# Altium schematic sheet 5V_converter.SchDoc
size A4; SheetNumber: 2; SheetTotal: 2
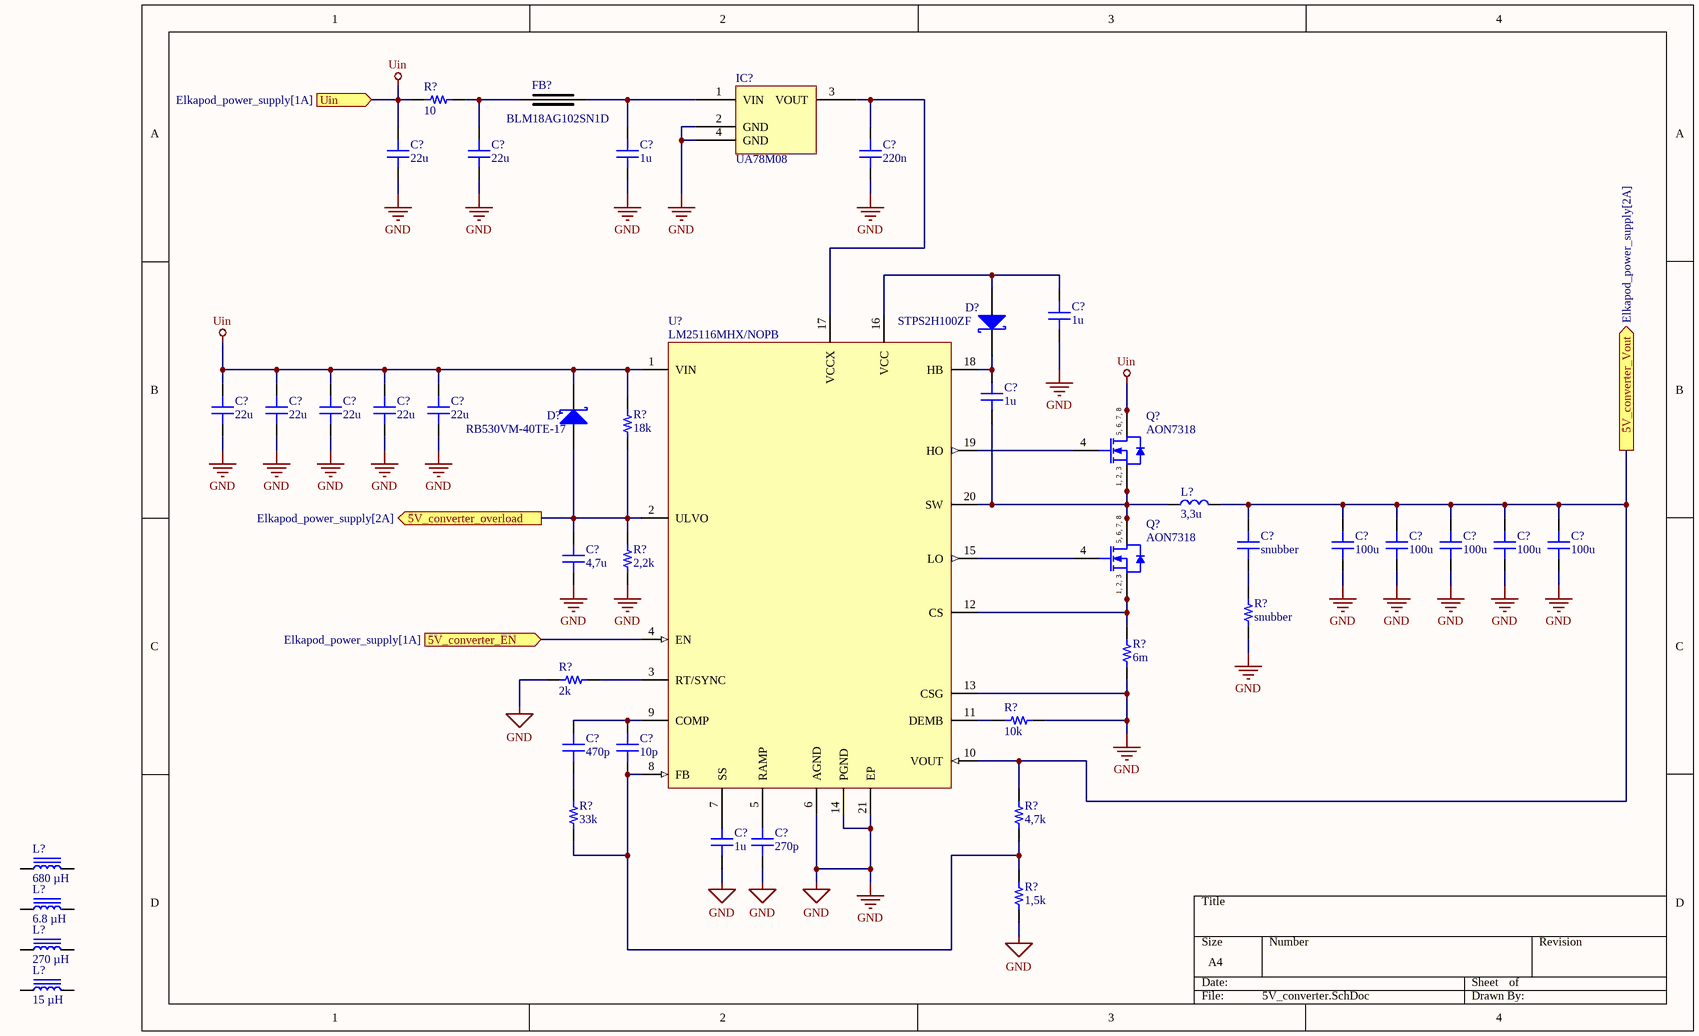
[diagram p0: 5V_converter.SchDoc]

## Parts
(Parts that share a designator on the sheet are numbered #1, #2 ... from top to bottom, then left to right.)
C?#1  22u  [CAP 0805_2012]
C?#2  22u  [CAP 0805_2012]
C?#3  1u  [CAP 0603_1608]
C?#4  220n  [CAP 0603_1608]
C?#5  1u  [CAP 0603_1608]
C?#6  1u  [CAP 0603_1608]
C?#7  22u  [CAP 0805_2012]
C?#8  22u  [CAP 0805_2012]
C?#9  22u  [CAP 0805_2012]
C?#10  22u  [CAP 0805_2012]
C?#11  22u  [CAP 0805_2012]
C?#12  snubber  [CAP 0603_1608]
C?#13  100u  [CAP 1210_3225 - 1MM]
C?#14  100u  [CAP 1210_3225 - 1MM]
C?#15  100u  [CAP 1210_3225 - 1MM]
C?#16  100u  [CAP 1210_3225 - 1MM]
C?#17  100u  [CAP 1210_3225 - 1MM]
C?#18  4,7u  [CAP 0603_1608]
C?#19  470p  [CAP 0603_1608]
C?#20  10p  [CAP 0603_1608]
C?#21  1u  [CAP 0603_1608]
C?#22  270p  [CAP 0603_1608]
D?#1  STPS2H100ZF  [DIOD-SOD-123-2_V]
D?#2  RB530VM-40TE-17  [SOD-323]
FB?  BLM18AG102SN1D  [0603FB-1KZ]
IC?  UA78M08  [TI SOT-223 DCY]
L?#1  3,3u  [13,2x12,5_INDUCTOR]
L?#2  680 µH  [TDK SLF12555]
L?#3  6.8 µH  [WURTH WE-PD 1260]
L?#4  270 µH  [BOURNS SRR1280]
L?#5  15 µH  [TAIYO YUDEN NRS5030]
Q?#1  AON7318  [INF-PG-TSDSON-8-1_V]
Q?#2  AON7318  [INF-PG-TSDSON-8-1_V]
R?#1  10  [RES 1206_3216]
R?#2  18k  [RES 0603_1608]
R?#3  2,2k  [RES 0603_1608]
R?#4  snubber  [RES 1206_3216]
R?#5  6m  [STACKPOLE CSM2512]
R?#6  2k  [RES 0603_1608]
R?#7  10k  [RES 0603_1608]
R?#8  33k  [RES 0603_1608]
R?#9  4,7k  [RES 0603_1608]
R?#10  1,5k  [RES 0603_1608]
U?  LM25116MHX/NOPB  [PWP0020A_L]

## Ports
5V_converter_EN (in, see Elkapod_power_supply[1A]), 5V_converter_overload (out, see Elkapod_power_supply[2A]), 5V_converter_Vout (out, see Elkapod_power_supply[2A]), Uin (in, see Elkapod_power_supply[1A])

## Nets
GND: C?#1.1 C?#2.1 C?#3.1 C?#4.1 C?#5.2 C?#7.1 C?#8.1 C?#9.1 C?#10.1 C?#11.1 C?#13.1 C?#14.1 C?#15.1 C?#16.1 C?#17.1 C?#18.1 C?#21.1 C?#22.1 IC?.2(GND) IC?.4(GND) R?#3.1 R?#4.1 R?#5.1 R?#6.2 R?#7.1 R?#10.2 U?.6(AGND) U?.13(CSG) U?.14(PGND) U?.21(EP)
Uin: C?#1.2 C?#7.2 C?#8.2 C?#9.2 C?#10.2 C?#11.2 D?#2.1(K) Q?#1.5(DRAIN) Q?#1.6(DRAIN) Q?#1.7(DRAIN) Q?#1.8(DRAIN) R?#1.1 R?#2.1 U?.1(VIN) ; port Uin
5V_converter_EN: U?.4(EN) ; port 5V_converter_EN
5V_converter_overload: C?#18.2 D?#2.2(A) R?#2.2 R?#3.2 U?.2(ULVO) ; port 5V_converter_overload
5V_converter_Vout: C?#12.2 C?#13.2 C?#14.2 C?#15.2 C?#16.2 C?#17.2 L?#1.2 R?#9.1 U?.10(VOUT) ; port 5V_converter_Vout
NetC?#2_2: C?#2.2 FB?.1 R?#1.2
NetC?#3_2: C?#3.2 FB?.2 IC?.1(VIN)
NetC?#4_2: C?#4.2 IC?.3(VOUT) U?.17(VCCX)
NetC?#5_1: C?#5.1 D?#1.1(A) U?.16(VCC)
NetC?#6_1: C?#6.1 L?#1.1 Q?#1.1(SOURCE) Q?#1.2(SOURCE) Q?#1.3(SOURCE) Q?#2.5(DRAIN) Q?#2.6(DRAIN) Q?#2.7(DRAIN) Q?#2.8(DRAIN) U?.20(SW)
NetC?#6_2: C?#6.2 D?#1.2(K) U?.18(HB)
NetC?#12_1: C?#12.1 R?#4.2
NetC?#19_1: C?#19.1 C?#20.1 U?.9(COMP)
NetC?#19_2: C?#19.2 R?#8.1
NetC?#20_2: C?#20.2 R?#8.2 R?#9.2 R?#10.1 U?.8(FB)
NetC?#21_2: C?#21.2 U?.7(SS)
NetC?#22_2: C?#22.2 U?.5(RAMP)
NetQ?#1_4: Q?#1.4(GATE) U?.19(HO)
NetQ?#2_1: Q?#2.1(SOURCE) Q?#2.2(SOURCE) Q?#2.3(SOURCE) R?#5.2 U?.12(CS)
NetQ?#2_4: Q?#2.4(GATE) U?.15(LO)
NetR?#6_1: R?#6.1 U?.3(RT/SYNC)
NetR?#7_2: R?#7.2 U?.11(DEMB)

Not connected (* = marked no-connect by the designer): L?#2 1 2; L?#3 1 2; L?#4 1 2; L?#5 1 2

## Notes on the sheet
- (in symbol BSZ050N03MS G) 5, 6, 7, 8; 1, 2, 3

## Library data of the parts
C?#1 C?#2 C?#7-C?#11 = VJ0805Y684KXQTW1BC: CAP CER 22UF 25V X7R 0805; manufacturer: Vishay Vitramon; Tolerance: ±10%; Voltage - Rated: 10V; Part Number: VJ0805Y684KXQTW1BC; Value: 22u; Applications: General Purpose; Capacitance: 22u; componentlink1description: Datasheet; componentlink1url: https://www.vishay.com/docs/28548/vjw1bcbascomseries.pdf; componentlink2description: DigiKey Link; componentlink2url: https://www.digikey.com/en/products/detail/vishay-vitramon/VJ0805Y684KXQTW1BC/8313569; Device Package: 0805 (2012 Metric); lastupdated: 09.02.2024 20:13:13; Lifecycle Status: Active; Minimum Order: 1; Mounting Type: Surface Mount, MLCC; Operating Temperature: -55°C ~ 125°C; Package / Case: 0805 (2012 Metric); packaging: TapeAndReel; partid: 57262; price: 0.05; series: VJ W1BC; Size / Dimension: 0.079" L x 0.049" W (2.00mm x 1.25mm); Temperature Coefficient: X7R; Thickness (Max): 0.053" (1.35mm)
C?#3 C?#5 C?#6 = C0603C272F3GAC7867: CAP CER 1uF 25V X5R 0603; manufacturer: KEMET; Temperature Coefficient: C0G, NP0; Tolerance: ±1%; Part Number: C0603C272F3GAC7867; Value: 1u; Applications: General Purpose; Capacitance: 1u; componentlink1description: Datasheet; componentlink1url: https://api.kemet.com/component-edge/download/datasheet/C0603C272F3GACTU.pdf; componentlink2description: DigiKey Link; componentlink2url: https://www.digikey.com/en/products/detail/kemet/C0603C272F3GAC7867/2200413; Device Package: 0603 (1608 Metric); Features: Low ESL; lastupdated: 09.02.2024 20:10:30; Lifecycle Status: Active; Minimum Order: 1; Mounting Type: Surface Mount, MLCC; Operating Temperature: -55°C ~ 125°C; Package / Case: 0603 (1608 Metric); packaging: TapeAndReel; partid: 2138; Part Status: Active; price: 0.40; series: SMD Comm C0G; Size / Dimension: 0.063" L x 0.031" W (1.60mm x 0.80mm); Thickness (Max): 0.034" (0.87mm); Voltage - Rated: 25V
C?#4 = C0603C272F3GAC7867: CAP CER 220nF 25V X5R 0603; manufacturer: KEMET; Temperature Coefficient: C0G, NP0; Tolerance: ±1%; Part Number: C0603C272F3GAC7867; Value: 220n; Applications: General Purpose; Capacitance: 220n; componentlink1description: Datasheet; componentlink1url: https://api.kemet.com/component-edge/download/datasheet/C0603C272F3GACTU.pdf; componentlink2description: DigiKey Link; componentlink2url: https://www.digikey.com/en/products/detail/kemet/C0603C272F3GAC7867/2200413; Device Package: 0603 (1608 Metric); Features: Low ESL; lastupdated: 09.02.2024 20:10:30; Lifecycle Status: Active; Minimum Order: 1; Mounting Type: Surface Mount, MLCC; Operating Temperature: -55°C ~ 125°C; Package / Case: 0603 (1608 Metric); packaging: TapeAndReel; partid: 2138; Part Status: Active; price: 0.40; series: SMD Comm C0G; Size / Dimension: 0.063" L x 0.031" W (1.60mm x 0.80mm); Thickness (Max): 0.034" (0.87mm); Voltage - Rated: 25V
C?#12 = C0603C272F3GAC7867: CAP CER 50V X5R 0603; manufacturer: KEMET; Temperature Coefficient: C0G, NP0; Tolerance: ±1%; Voltage - Rated: 25V; Part Number: C0603C272F3GAC7867; Value: snubber; Applications: General Purpose; Capacitance: snubber; componentlink1description: Datasheet; componentlink1url: https://api.kemet.com/component-edge/download/datasheet/C0603C272F3GACTU.pdf; componentlink2description: DigiKey Link; componentlink2url: https://www.digikey.com/en/products/detail/kemet/C0603C272F3GAC7867/2200413; Device Package: 0603 (1608 Metric); Features: Low ESL; lastupdated: 09.02.2024 20:10:30; Lifecycle Status: Active; Minimum Order: 1; Mounting Type: Surface Mount, MLCC; Operating Temperature: -55°C ~ 125°C; Package / Case: 0603 (1608 Metric); packaging: TapeAndReel; partid: 2138; Part Status: Active; price: 0.40; series: SMD Comm C0G; Size / Dimension: 0.063" L x 0.031" W (1.60mm x 0.80mm); Thickness (Max): 0.034" (0.87mm)
C?#13-C?#17 = CAN13X104KARAC7800: CAP CER 1210 100UF 10V X7R; manufacturer: KEMET; Tolerance: ±10%; Voltage - Rated: 250VAC; Part Number: CAN13X104KARAC7800; Value: 100u; Applications: Boardflex Sensitive; Capacitance: 100u; componentlink1description: Datasheet; componentlink1url: //media.digikey.com/pdf/Data%20Sheets/Kemet%20PDFs/CAN13X104KARACTU_Spec.pdf; componentlink2description: DigiKey Link; componentlink2url: https://www.digikey.com/en/products/detail/kemet/CAN13X104KARAC7800/9962480; Device Package: 1210 (3225 Metric); Features: Low ESL, Soft Termination; lastupdated: 04.06.2024 19:21:07; Lifecycle Status: Active; Minimum Order: 1; Mounting Type: Surface Mount, MLCC; Operating Temperature: -55°C ~ 125°C; Package / Case: 1210 (3225 Metric); packaging: TapeAndReel; partid: 23615; Part Status: Active; price: 0.39; series: CAN SMD Indust X7R; Size / Dimension: 0.130" L x 0.102" W (3.30mm x 2.60mm); Temperature Coefficient: X7R; Thickness (Max): 0.110" (2.80mm)
C?#18 = C0603C272F3GAC7867: CAP CER 4,7uF 25V X5R 0603; manufacturer: KEMET; Temperature Coefficient: C0G, NP0; Tolerance: ±1%; Part Number: C0603C272F3GAC7867; Value: 4,7u; Applications: General Purpose; Capacitance: 4,7u; componentlink1description: Datasheet; componentlink1url: https://api.kemet.com/component-edge/download/datasheet/C0603C272F3GACTU.pdf; componentlink2description: DigiKey Link; componentlink2url: https://www.digikey.com/en/products/detail/kemet/C0603C272F3GAC7867/2200413; Device Package: 0603 (1608 Metric); Features: Low ESL; lastupdated: 09.02.2024 20:10:30; Lifecycle Status: Active; Minimum Order: 1; Mounting Type: Surface Mount, MLCC; Operating Temperature: -55°C ~ 125°C; Package / Case: 0603 (1608 Metric); packaging: TapeAndReel; partid: 2138; Part Status: Active; price: 0.40; series: SMD Comm C0G; Size / Dimension: 0.063" L x 0.031" W (1.60mm x 0.80mm); Thickness (Max): 0.034" (0.87mm); Voltage - Rated: 25V
C?#19 = C0603C272F3GAC7867: CAP CER 470pF 50V G0C 0603; manufacturer: KEMET; Temperature Coefficient: C0G, NP0; Tolerance: ±1%; Voltage - Rated: 25V; Part Number: C0603C272F3GAC7867; Value: 470p; Applications: General Purpose; Capacitance: 470p; componentlink1description: Datasheet; componentlink1url: https://api.kemet.com/component-edge/download/datasheet/C0603C272F3GACTU.pdf; componentlink2description: DigiKey Link; componentlink2url: https://www.digikey.com/en/products/detail/kemet/C0603C272F3GAC7867/2200413; Device Package: 0603 (1608 Metric); Features: Low ESL; lastupdated: 09.02.2024 20:10:30; Lifecycle Status: Active; Minimum Order: 1; Mounting Type: Surface Mount, MLCC; Operating Temperature: -55°C ~ 125°C; Package / Case: 0603 (1608 Metric); packaging: TapeAndReel; partid: 2138; Part Status: Active; price: 0.40; series: SMD Comm C0G; Size / Dimension: 0.063" L x 0.031" W (1.60mm x 0.80mm); Thickness (Max): 0.034" (0.87mm)
C?#20 = C0603C272F3GAC7867: CAP CER 10pF 50V G0C 0603; manufacturer: KEMET; Temperature Coefficient: C0G, NP0; Tolerance: ±1%; Voltage - Rated: 25V; Part Number: C0603C272F3GAC7867; Value: 10p; Applications: General Purpose; Capacitance: 10p; componentlink1description: Datasheet; componentlink1url: https://api.kemet.com/component-edge/download/datasheet/C0603C272F3GACTU.pdf; componentlink2description: DigiKey Link; componentlink2url: https://www.digikey.com/en/products/detail/kemet/C0603C272F3GAC7867/2200413; Device Package: 0603 (1608 Metric); Features: Low ESL; lastupdated: 09.02.2024 20:10:30; Lifecycle Status: Active; Minimum Order: 1; Mounting Type: Surface Mount, MLCC; Operating Temperature: -55°C ~ 125°C; Package / Case: 0603 (1608 Metric); packaging: TapeAndReel; partid: 2138; Part Status: Active; price: 0.40; series: SMD Comm C0G; Size / Dimension: 0.063" L x 0.031" W (1.60mm x 0.80mm); Thickness (Max): 0.034" (0.87mm)
C?#21 = C0603C272F3GAC7867: CAP CER 1uF 16V X5R 0603; manufacturer: KEMET; Temperature Coefficient: C0G, NP0; Tolerance: ±1%; Voltage - Rated: 25V; Part Number: C0603C272F3GAC7867; Value: 1u; Applications: General Purpose; Capacitance: 1u; componentlink1description: Datasheet; componentlink1url: https://api.kemet.com/component-edge/download/datasheet/C0603C272F3GACTU.pdf; componentlink2description: DigiKey Link; componentlink2url: https://www.digikey.com/en/products/detail/kemet/C0603C272F3GAC7867/2200413; Device Package: 0603 (1608 Metric); Features: Low ESL; lastupdated: 09.02.2024 20:10:30; Lifecycle Status: Active; Minimum Order: 1; Mounting Type: Surface Mount, MLCC; Operating Temperature: -55°C ~ 125°C; Package / Case: 0603 (1608 Metric); packaging: TapeAndReel; partid: 2138; Part Status: Active; price: 0.40; series: SMD Comm C0G; Size / Dimension: 0.063" L x 0.031" W (1.60mm x 0.80mm); Thickness (Max): 0.034" (0.87mm)
C?#22 = C0603C272F3GAC7867: CAP CER 270pF 50V G0C 0603; manufacturer: KEMET; Temperature Coefficient: C0G, NP0; Tolerance: ±1%; Voltage - Rated: 25V; Part Number: C0603C272F3GAC7867; Value: 270p; Applications: General Purpose; Capacitance: 270p; componentlink1description: Datasheet; componentlink1url: https://api.kemet.com/component-edge/download/datasheet/C0603C272F3GACTU.pdf; componentlink2description: DigiKey Link; componentlink2url: https://www.digikey.com/en/products/detail/kemet/C0603C272F3GAC7867/2200413; Device Package: 0603 (1608 Metric); Features: Low ESL; lastupdated: 09.02.2024 20:10:30; Lifecycle Status: Active; Minimum Order: 1; Mounting Type: Surface Mount, MLCC; Operating Temperature: -55°C ~ 125°C; Package / Case: 0603 (1608 Metric); packaging: TapeAndReel; partid: 2138; Part Status: Active; price: 0.40; series: SMD Comm C0G; Size / Dimension: 0.063" L x 0.031" W (1.60mm x 0.80mm); Thickness (Max): 0.034" (0.87mm)
D?#1 = CMP-0303-00004-1: Schottky diode; 2A; 100V
D?#2 = BAS140W: Schottky diode; 0,1A; 40V; Published: 21-Mar-2003; LatestRevisionDate: 19-Mar-2004; LatestRevisionNote: Silkscreen size reduced.; DatasheetDocument: Oct-1999; PackageDocument: Sep-2000; PackageReference: SOD-323; Publisher: Altium Limited; ComponentLink1Description: Manufacturer Link; ComponentLink1URL: http://www.infineon.com/; ComponentLink2Description: Datasheet; ComponentLink2URL: http://www.infineon.com/upload/Document/cmc_upload/documents/009/386/bas70_bas170series_1.pdf
FB? = 0603FB-1KZ: FERRITE BEAD 1000 OHM 400mA
IC? = LM340MP-5.0/NOPB: IC REG LINEAR 8V 0,5A SOT223; Manufacturer: Texas Instruments; Current - Output: 1.5A; Number of Regulators: 1; Output Configuration: Positive; Output Type: Fixed; Part Number: UA78M08; ComponentLink1Description: Datasheet; ComponentLink1URL: http://www.ti.com/general/docs/suppproductinfo.tsp?distId=10&gotoUrl=http%3A%2F%2Fwww.ti.com%2Flit%2Fgpn%2Flm340; ComponentLink2Description: DigiKey Link; ComponentLink2URL: //digikey.com/product-detail/en/texas-instruments/LM340MP-5.0-NOPB/LM340MP-5.0-NOPBTR-ND/270717; Lifecycle Status: 0; Operating Temperature: 0°C ~ 125°C; Package / Case: TO-261-4, TO-261AA; Packaging: TapeAndReel; Voltage - Output (Min/Fixed): 8V
L?#1 = 13,2x12,5_INDUCTOR: SMD power inductor; Imax = 19,7A; Isat = 22,5A
L?#2 = SLF12555T-681MR43-PF: FIXED IND 680UH 730MA 912MOHM SM; Manufacturer: TDK Corporation; Current - Saturation: 430mA; DC Resistance (DCR): 912mOhm Max; Inductance Frequency - Test: 1 kHz; Material - Core: Ferrite; Shielding: Shielded; Tolerance: ±20%; Type: Drum Core, Wirewound; Part Number: SLF12555T-681MR43-PF; ComponentLink1Description: Datasheet; ComponentLink1URL: https://product.tdk.com/info/en/catalog/datasheets/inductor_commercial_power_slf12555_en.pdf?ref_disty=digikey; ComponentLink2Description: DigiKey Link; ComponentLink2URL: https://www.digikey.com/en/products/detail/tdk-corporation/SLF12555T-681MR43-PF/761650; Current Rating (Amps): 730 mA; Device Package: Nonstandard; Height - Seated (Max): 0.228" (5.80mm); Inductance: 680 µH; LastUpdated: 03.06.2024 20:02:40; Lifecycle Status: Active; Minimum Order: 1; Mounting Type: Surface Mount; Operating Temperature: -40°C ~ 105°C; Package / Case: Nonstandard; Packaging: TapeAndReel; PartId: 101; Part Status: Active; Price: 0.64; Series: SLF; Size / Dimension: 0.492" L x 0.492" W (12.50mm x 12.50mm); Supplier 1: DigiKey; Supplier Part Number 1: 445-174402-1-ND; Value: 680 µH
L?#3 = 744771006: FIXED IND 6.8UH 6.25A 22MOHM SMD; Manufacturer: Würth Elektronik; Current - Saturation: 6.4A; DC Resistance (DCR): 22mOhm Max; Frequency - Self Resonant: 27MHz; Inductance Frequency - Test: 1 kHz; Material - Core: Ferrite; Shielding: Shielded; Tolerance: ±20%; Type: Drum Core, Wirewound; Part Number: 744771006; ComponentLink1Description: Datasheet; ComponentLink1URL: https://katalog.we-online.de/pbs/datasheet/744771006.pdf; ComponentLink2Description: DigiKey Link; ComponentLink2URL: https://www.digikey.com/en/products/detail/würth-elektronik/744771006/3476684; Current Rating (Amps): 6.25 A; Device Package: Nonstandard; Height - Seated (Max): 0.236" (6.00mm); Inductance: 6.8 µH; LastUpdated: 03.06.2024 20:26:19; Lifecycle Status: Active; Minimum Order: 1; Mounting Type: Surface Mount; Operating Temperature: -40°C ~ 125°C; Package / Case: Nonstandard; Packaging: TapeAndReel; PartId: 5713; Part Status: Active; Price: 1.18; Ratings: AEC-Q200; Series: WE-PD; Size / Dimension: 0.472" L x 0.472" W (12.00mm x 12.00mm); Supplier 1: DigiKey; Supplier Part Number 1: 732-4114-1-ND; Value: 6.8 µH
L?#4 = SRR1280-271K: FIXED IND 270UH 1.2A 450MOHM SMD; Manufacturer: Bourns Inc.; Current - Saturation: 1.6A; DC Resistance (DCR): 450mOhm Max; Frequency - Self Resonant: 3.1MHz; Inductance Frequency - Test: 100 kHz; Material - Core: Ferrite; Q @ Freq: 20 @ 796kHz; Shielding: Shielded; Tolerance: ±10%; Type: Drum Core, Wirewound; Part Number: SRR1280-271K; ComponentLink1Description: Datasheet; ComponentLink1URL: https://www.bourns.com/docs/Product-Datasheets/SRR1280.pdf; ComponentLink2Description: DigiKey Link; ComponentLink2URL: https://www.digikey.com/en/products/detail/bourns-inc/SRR1280-271K/1970009; Current Rating (Amps): 1.2 A; Device Package: Nonstandard; Height - Seated (Max): 0.315" (8.00mm); Inductance: 270 µH; LastUpdated: 03.06.2024 20:02:37; Lifecycle Status: Active; Minimum Order: 1; Mounting Type: Surface Mount; Operating Temperature: -40°C ~ 125°C; Package / Case: Nonstandard; Packaging: TapeAndReel; PartId: 13; Part Status: Active; Price: 0.51; Series: SRR1280; Size / Dimension: 0.492" L x 0.492" W (12.50mm x 12.50mm); Supplier 1: DigiKey; Supplier Part Number 1: SRR1280-271KCT-ND; Value: 270 µH
L?#5 = NRS5030T150MMGJ: FIXED IND 15UH 1.4A 125 MOHM SMD; Manufacturer: Taiyo Yuden; Current - Saturation: 1.6A; Frequency - Self Resonant: 14MHz; Inductance Frequency - Test: 100 kHz; Material - Core: Ferrite; Shielding: Shielded; Tolerance: ±20%; Type: Drum Core, Wirewound; Part Number: NRS5030T150MMGJ; ComponentLink1Description: Datasheet; ComponentLink1URL: https://www.yuden.co.jp/productdata/catalog/wound04_e.pdf; ComponentLink2Description: DigiKey Link; ComponentLink2URL: https://www.digikey.com/en/products/detail/taiyo-yuden/NRS5030T150MMGJ/4157842; Current Rating (Amps): 1.4 A; DC Resistance (DCR): 125mOhm; Device Package: Nonstandard; Height - Seated (Max): 0.118" (3.00mm); Inductance: 15 µH; LastUpdated: 03.06.2024 20:23:07; Lifecycle Status: Active; Minimum Order: 1; Mounting Type: Surface Mount; Operating Temperature: -25°C ~ 120°C; Package / Case: Nonstandard; Packaging: TapeAndReel; PartId: 3411; Part Status: Active; Price: 0.11; Series: NR, S Type; Size / Dimension: 0.193" L x 0.193" W (4.90mm x 4.90mm); Supplier 1: DigiKey; Supplier Part Number 1: 587-3454-1-ND; Value: 15 µH
Q?#1 Q?#2 = BSZ050N03MS G: N-Channel Power-MOSFET, 30 V VDS, 50 A ID, PG-TSDSON-8-1; Manufacturer: Infineon; ID (max): 50 A; IDpuls (max): 190 A; Polarity: N; PackageReference: PG-TSDSON-8-1; PackageDescription: 8-Pin Plastic (Green) Thin Dual Small Outline Non-Leaded Package, 3.3 x 3.3 mm Body, 0.65 mm Pitch; Mounting Technology: Surface Mount
R?#1 = KRL1632E-M-R120-F-T5: RES 10 OHM 1% 3/4W 1206; Manufacturer: Susumu; Power (Watts): 0.75W, 3/4W; Temperature Coefficient: ±50ppm/°C; Part Number: KRL1632E-M-R120-F-T5; ComponentLink1Description: Datasheet; ComponentLink1URL: http://www.susumu.co.jp/common/pdf/n_catalog_partition09_en.pdf; ComponentLink2Description: DigiKey Link; ComponentLink2URL: https://www.digikey.com/en/products/detail/susumu/KRL1632E-M-R120-F-T5/3738009; Composition: Metal Foil; Device Package: 1206 (3216 Metric); Features: Automotive AEC-Q200, Current Sense; Height - Seated (Max): 0.028" (0.70mm); LastUpdated: 09.02.2024 20:54:46; Lifecycle Status: Active; Minimum Order: 1; Number of Terminations: 2; Operating Temperature: -55°C ~ 155°C; Package / Case: 1206 (3216 Metric); Packaging: TapeAndReel; PartId: 26840; Part Status: Active; Price: 0.09; Ratings: AEC-Q200; Resistance: 10; Series: KRL; Size / Dimension: 0.126" L x 0.063" W (3.20mm x 1.60mm); Supplier Device Package: 1206; Tolerance: ±1%; Value: 10
R?#2 = RNCS0603BKE10K0: RES 18K OHM 1% 0,1W 0603; Manufacturer: Stackpole Electronics Inc; Power (Watts): 0.063W, 1/16W; Temperature Coefficient: ±25ppm/°C; Tolerance: ±0.1%; Part Number: RNCS0603BKE10K0; Value: 18k; Composition: Thin Film; Device Package: 0603 (1608 Metric); Features: Anti-Corrosive, Automotive AEC-Q200, Moisture Resistant; Height - Seated (Max): 0.022" (0.55mm); LastUpdated: 09.02.2024 20:43:37; Lifecycle Status: Active; Minimum Order: 1; Number of Terminations: 2; Operating Temperature: -55°C ~ 155°C; Package / Case: 0603 (1608 Metric); Packaging: TapeAndReel; PartId: 4838; Part Status: Active; Price: 0.06; Ratings: AEC-Q200; Resistance: 18k; Series: RNCS; Size / Dimension: 0.061" L x 0.031" W (1.55mm x 0.80mm); Supplier Device Package: 0603
R?#3 = RNCS0603BKE10K0: RES 2,2K OHM 1% 0,1W 0603; Manufacturer: Stackpole Electronics Inc; Power (Watts): 0.063W, 1/16W; Temperature Coefficient: ±25ppm/°C; Tolerance: ±0.1%; Part Number: RNCS0603BKE10K0; Value: 2,2k; Composition: Thin Film; Device Package: 0603 (1608 Metric); Features: Anti-Corrosive, Automotive AEC-Q200, Moisture Resistant; Height - Seated (Max): 0.022" (0.55mm); LastUpdated: 09.02.2024 20:43:37; Lifecycle Status: Active; Minimum Order: 1; Number of Terminations: 2; Operating Temperature: -55°C ~ 155°C; Package / Case: 0603 (1608 Metric); Packaging: TapeAndReel; PartId: 4838; Part Status: Active; Price: 0.06; Ratings: AEC-Q200; Resistance: 2,2k; Series: RNCS; Size / Dimension: 0.061" L x 0.031" W (1.55mm x 0.80mm); Supplier Device Package: 0603
R?#4 = RT1206BRD0775KL: Manufacturer: Yageo; Power (Watts): 0.25W, 1/4W; Temperature Coefficient: ±25ppm/°C; Tolerance: ±0.1%; Part Number: RT1206BRD0775KL; Composition: Thin Film; Device Package: 1206 (3216 Metric); Height - Seated (Max): 0.026" (0.65mm); LastUpdated: 09.02.2024 20:54:46; Lifecycle Status: Active; Minimum Order: 1; Number of Terminations: 2; Operating Temperature: -55°C ~ 155°C; Package / Case: 1206 (3216 Metric); Packaging: TapeAndReel; PartId: 26866; Part Status: Active; Price: 0.09; Series: RT; Size / Dimension: 0.122" L x 0.063" W (3.10mm x 1.60mm); Supplier Device Package: 1206
R?#5 = CSM2512FT20L0: RES 0,006 OHM 1% 3W 2512; manufacturer: Stackpole Electronics Inc; Temperature Coefficient: ±50ppm/°C; value: 20 mOhms; Part Number: CSM2512FT20L0; componentlink1description: Datasheet; componentlink1url: https://www.seielect.com/Catalog/SEI-CSM.PDF; componentlink2description: DigiKey Link; componentlink2url: https://www.digikey.com/en/products/detail/stackpole-electronics-inc/CSM2512FT20L0/6270239; Composition: Metal Element; Device Package: 2512 (6332 Metric); Features: Current Sense; Height - Seated (Max): 0.035" (0.90mm); lastupdated: 03.06.2024 20:27:03; Lifecycle Status: Active; Minimum Order: 4000; Number of Terminations: 2; Operating Temperature: -55°C ~ 170°C; Package / Case: 2512 (6332 Metric); packaging: TapeAndReel; Part Status: Active; Power (Watts): 3W; price: 0.19; Resistance: 6m; series: CSM; Size / Dimension: 0.252" L x 0.126" W (6.40mm x 3.20mm); Supplier Device Package: 2512; Tolerance: ±1%
R?#6 = RNCS0603BKE10K0: RES 2K OHM 1% 0,1W 0603; Manufacturer: Stackpole Electronics Inc; Power (Watts): 0.063W, 1/16W; Temperature Coefficient: ±25ppm/°C; Tolerance: ±0.1%; Part Number: RNCS0603BKE10K0; Value: 2k; Composition: Thin Film; Device Package: 0603 (1608 Metric); Features: Anti-Corrosive, Automotive AEC-Q200, Moisture Resistant; Height - Seated (Max): 0.022" (0.55mm); LastUpdated: 09.02.2024 20:43:37; Lifecycle Status: Active; Minimum Order: 1; Number of Terminations: 2; Operating Temperature: -55°C ~ 155°C; Package / Case: 0603 (1608 Metric); Packaging: TapeAndReel; PartId: 4838; Part Status: Active; Price: 0.06; Ratings: AEC-Q200; Resistance: 2k; Series: RNCS; Size / Dimension: 0.061" L x 0.031" W (1.55mm x 0.80mm); Supplier Device Package: 0603
R?#7 = RNCS0603BKE10K0: RES 10K OHM 1% 0,1W 0603; Manufacturer: Stackpole Electronics Inc; Power (Watts): 0.063W, 1/16W; Temperature Coefficient: ±25ppm/°C; Tolerance: ±0.1%; Part Number: RNCS0603BKE10K0; Value: 10k; Composition: Thin Film; Device Package: 0603 (1608 Metric); Features: Anti-Corrosive, Automotive AEC-Q200, Moisture Resistant; Height - Seated (Max): 0.022" (0.55mm); LastUpdated: 09.02.2024 20:43:37; Lifecycle Status: Active; Minimum Order: 1; Number of Terminations: 2; Operating Temperature: -55°C ~ 155°C; Package / Case: 0603 (1608 Metric); Packaging: TapeAndReel; PartId: 4838; Part Status: Active; Price: 0.06; Ratings: AEC-Q200; Resistance: 10k; Series: RNCS; Size / Dimension: 0.061" L x 0.031" W (1.55mm x 0.80mm); Supplier Device Package: 0603
R?#8 = RNCS0603BKE10K0: RES 33K OHM 1% 0,1W 0603; Manufacturer: Stackpole Electronics Inc; Power (Watts): 0.063W, 1/16W; Temperature Coefficient: ±25ppm/°C; Tolerance: ±0.1%; Part Number: RNCS0603BKE10K0; Value: 33k; Composition: Thin Film; Device Package: 0603 (1608 Metric); Features: Anti-Corrosive, Automotive AEC-Q200, Moisture Resistant; Height - Seated (Max): 0.022" (0.55mm); LastUpdated: 09.02.2024 20:43:37; Lifecycle Status: Active; Minimum Order: 1; Number of Terminations: 2; Operating Temperature: -55°C ~ 155°C; Package / Case: 0603 (1608 Metric); Packaging: TapeAndReel; PartId: 4838; Part Status: Active; Price: 0.06; Ratings: AEC-Q200; Resistance: 33k; Series: RNCS; Size / Dimension: 0.061" L x 0.031" W (1.55mm x 0.80mm); Supplier Device Package: 0603
R?#9 = RNCS0603BKE10K0: RES 4,7K OHM 1% 0,1W 0603; Manufacturer: Stackpole Electronics Inc; Power (Watts): 0.063W, 1/16W; Temperature Coefficient: ±25ppm/°C; Tolerance: ±0.1%; Part Number: RNCS0603BKE10K0; Value: 4,7k; Composition: Thin Film; Device Package: 0603 (1608 Metric); Features: Anti-Corrosive, Automotive AEC-Q200, Moisture Resistant; Height - Seated (Max): 0.022" (0.55mm); LastUpdated: 09.02.2024 20:43:37; Lifecycle Status: Active; Minimum Order: 1; Number of Terminations: 2; Operating Temperature: -55°C ~ 155°C; Package / Case: 0603 (1608 Metric); Packaging: TapeAndReel; PartId: 4838; Part Status: Active; Price: 0.06; Ratings: AEC-Q200; Resistance: 4,7k; Series: RNCS; Size / Dimension: 0.061" L x 0.031" W (1.55mm x 0.80mm); Supplier Device Package: 0603
R?#10 = RNCS0603BKE10K0: RES 1,5K OHM 1% 0,1W 0603; Manufacturer: Stackpole Electronics Inc; Power (Watts): 0.063W, 1/16W; Temperature Coefficient: ±25ppm/°C; Tolerance: ±0.1%; Part Number: RNCS0603BKE10K0; Value: 1,5k; Composition: Thin Film; Device Package: 0603 (1608 Metric); Features: Anti-Corrosive, Automotive AEC-Q200, Moisture Resistant; Height - Seated (Max): 0.022" (0.55mm); LastUpdated: 09.02.2024 20:43:37; Lifecycle Status: Active; Minimum Order: 1; Number of Terminations: 2; Operating Temperature: -55°C ~ 155°C; Package / Case: 0603 (1608 Metric); Packaging: TapeAndReel; PartId: 4838; Part Status: Active; Price: 0.06; Ratings: AEC-Q200; Resistance: 1,5k; Series: RNCS; Size / Dimension: 0.061" L x 0.031" W (1.55mm x 0.80mm); Supplier Device Package: 0603
U? = LM25116MHX/NOPB: Wide Range Synchronous Buck Controller, 20-pin TSSOP-EP, Pb-Free; Manufacturer: Texas Instruments; CompType: Switcher; PowerWise: Y; PackageTopMarking: NSUZXYTT*LM25116*MH; PackageDescription: Molded TSSOP, Jedec, 6.5 x 4.4 x 0.9mm Body, 20 Lead, 0.65mm Pitch, Exposed Pad; PinCount: 20; Code_JEDEC: MO-153-ACT; ComponentLink1URL: http://www.ti.com/general/docs/lit/getliterature.tsp?genericPartNumber=LM25116&fileType=pdf; RoHS: Y; ComponentLink1Description: Datasheet URL; PackageReference: PWP0020A